# EasyEDA Pro project ProPrj_AIoT-NTU-Prototype_2026-03-28.epro, schematic Extension Board
Board Name: Extension Board; Create Date: 2026-03-23; Page Name: P1; Project Name: AIoT-NTU-Prototype; Schematic Name: Extension Board; Update Date: 2026-03-24; Company: EasyEDA.com; Page Size: A4; Version: V1.0
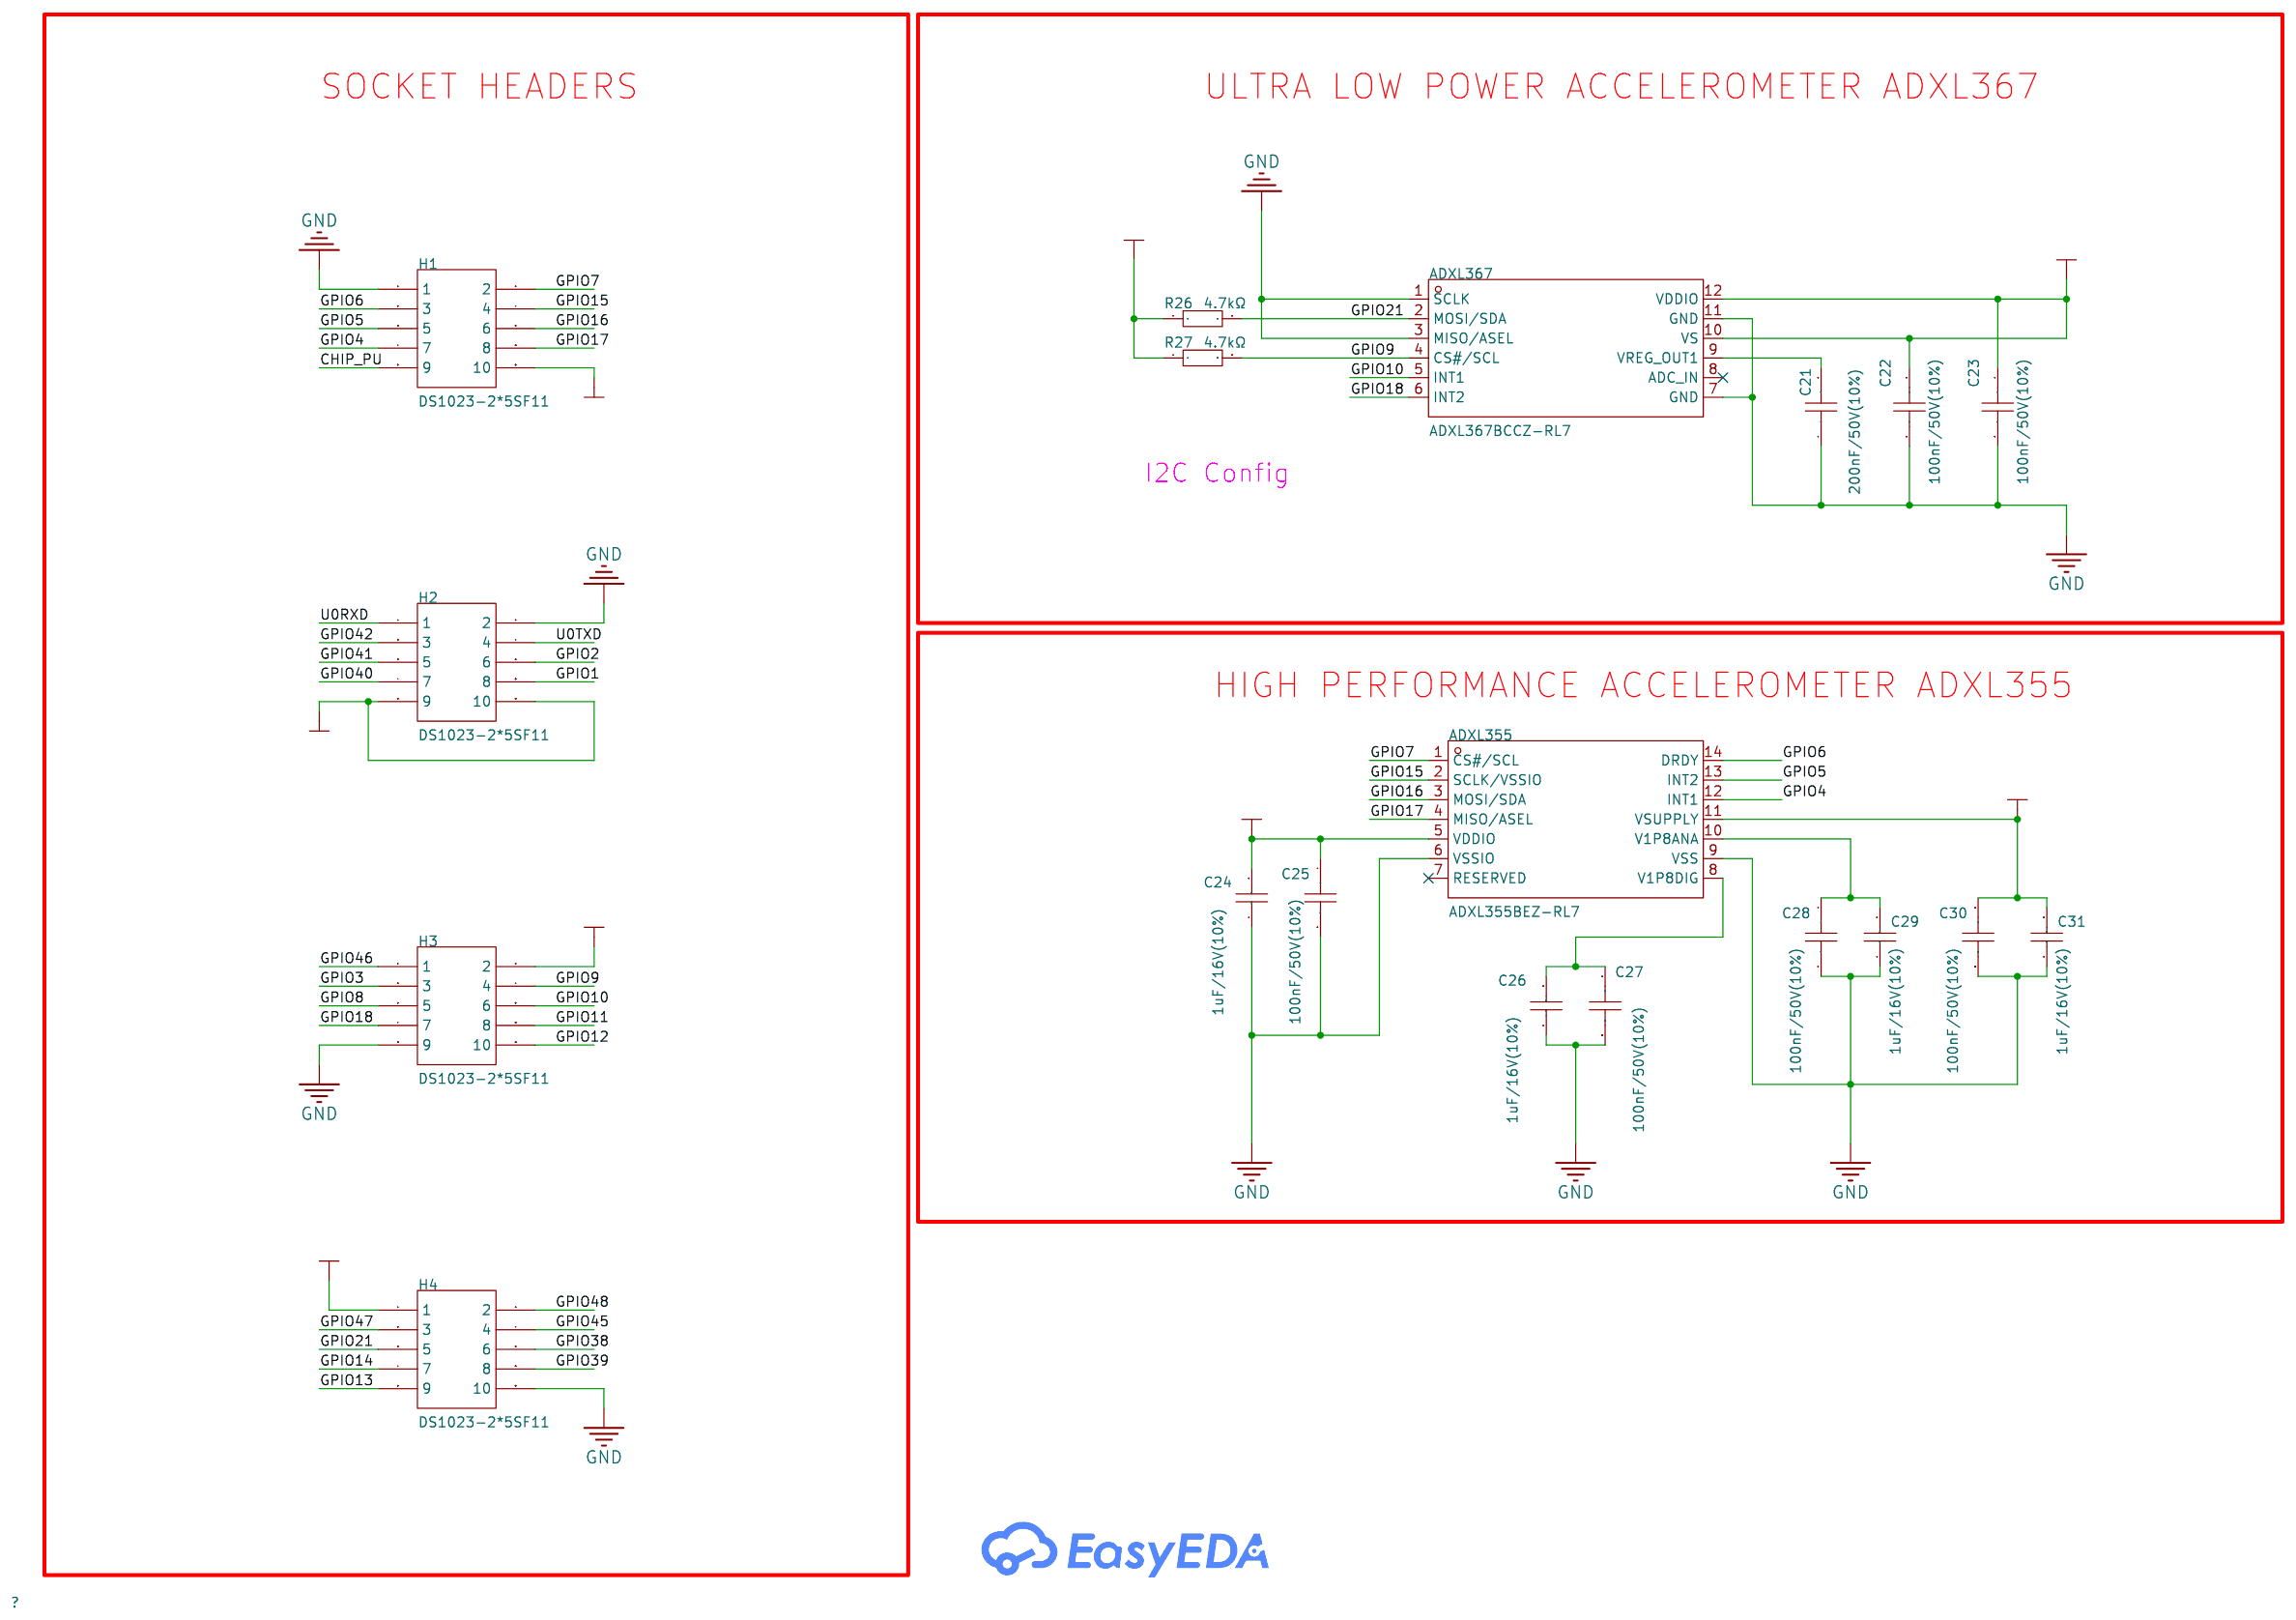
[diagram p0: schematic sheet]

## Parts
ADXL355  ADXL355BEZ-RL7  [LCC-14_L6.0-W6.0-P1.27-TL]
ADXL367  ADXL367BCCZ-RL7  [LGA-12_L2.3-W2.2-P0.50-TL]
C21  200nF/50V(10%)  [C0805]
C22  100nF/50V(10%)  [C0603]
C23  100nF/50V(10%)  [C0603]
C24  1uF/16V(10%)  [C0603]
C25  100nF/50V(10%)  [C0603]
C26  1uF/16V(10%)  [C0603]
C27  100nF/50V(10%)  [C0603]
C28  100nF/50V(10%)  [C0603]
C29  1uF/16V(10%)  [C0603]
C30  100nF/50V(10%)  [C0603]
C31  1uF/16V(10%)  [C0603]
H1  DS1023-2*5SF11  [HDR-TH_10P-P2.54-V-F-R2-C5-S2.54]
H2  DS1023-2*5SF11  [HDR-TH_10P-P2.54-V-F-R2-C5-S2.54]
H3  DS1023-2*5SF11  [HDR-TH_10P-P2.54-V-F-R2-C5-S2.54]
H4  DS1023-2*5SF11  [HDR-TH_10P-P2.54-V-F-R2-C5-S2.54]
R26  4.7kΩ  [R0603]
R27  4.7kΩ  [R0603]

## Library data of the parts
ADXL355 = ADXL355BEZ-RL7: LCSC Part Name: 带数字输出的低噪声、低漂移、低功耗3轴加速度计; Supplier Part: C515892; Manufacturer: ADI(亚德诺); Supplier Footprint: LCC-14(6x6); JLCPCB Part Class: Extended Part; Datasheet: https://item.szlcsc.com/datasheet/ADXL355BEZ-RL7/531509.html; Supplier: LCSC
ADXL367 = ADXL367BCCZ-RL7: Accelerometer Sensing Axis:X,Y,Z Acceleration Measurement Range (MAX):±8g Acceleration Measurement Range (MAX):±8g Sensor Type:Accelerometer Output Bits:14bit Interface:I2C；SPI Voltage - Supply:1.1V~3.6V Voltage - Supply:1.1V~3.6V Standby Current:40nA Ope; LCSC Part Name: 微功耗，三轴，±2 g/±4 g/±8 g 数字输出 MEMS 加速度计; Supplier Part: C17643415; Manufacturer: ADI(亚德诺); Supplier Footprint: LGA-12(2.2x2.3); JLCPCB Part Class: Extended Part; Datasheet: https://item.szlcsc.com/datasheet/ADXL367BCCZ-RL7/18772676.html; Supplier: LCSC; Accelerometer Sensing Axis: X,Y,Z; Acceleration Measurement Range (MAX): ±8g; Sensor Type: Accelerometer; Output Bits: 14bit; Interface: I2C；SPI; Voltage - Supply: 1.1V~3.6V; Standby Current: 40nA; Operating Temperature: -40℃~+85℃
C21 = NL0805B204K500CPBN: Capacitance:200nF Tolerance:±10% Tolerance:±10% Voltage Rating:50V Temperature Coefficient:-; LCSC Part Name: 200nF ±10% 50V; Supplier Part: C918135; Manufacturer: HUI JU(汇聚); Supplier Footprint: 0805; JLCPCB Part Class: Extended Part; Datasheet: https://item.szlcsc.com/datasheet/NL0805B204K500CPBN/994086.html; Supplier: LCSC; Tolerance: ±10%; Voltage Rating: 50V
C22 C23 C25 C27 C28 C30 = CC0603KRX7R9BB104: Capacitance:100nF Tolerance:±10% Tolerance:±10% Voltage Rating:50V Temperature Coefficient:X7R; LCSC Part Name: 100nF ±10% 50V; Supplier Part: C14663; Manufacturer: YAGEO(国巨); Supplier Footprint: 0603; JLCPCB Part Class: Basic Part; Datasheet: https://item.szlcsc.com/datasheet/CC0603KRX7R9BB104/15331.html; Supplier: LCSC; Tolerance: ±10%; Voltage Rating: 50V; Temperature Coefficient: X7R
C24 C26 C29 C31 = CL10A105KO8NNNC: Capacitance:1uF Tolerance:±10% Tolerance:±10% Voltage Rating:16V Temperature Coefficient:X5R; LCSC Part Name: 1uF ±10% 16V; Supplier Part: C1592; Manufacturer: SAMSUNG(三星); Supplier Footprint: 0603; JLCPCB Part Class: Extended Part; Datasheet: https://item.szlcsc.com/datasheet/CL10A105KO8NNNC/1944.html; Supplier: LCSC; Tolerance: ±10%; Voltage Rating: 16V; Temperature Coefficient: X5R
H1-H4 = DS1023-2*5SF11: Holes Structure:2x5P Pitch:2.54mm Row Spacing:2.54mm Mounting Type:Through Hole Number of Rows:2 Number of Positions:10P Current Rating:3A Voltage Rating (Max):600V Holes Direction:Top Insulation Height:8.5mm Contact Material:- Contact Plating:Gold Operat; LCSC Part Name: 黑色 2x5P 间距:2.54mm 直插; Supplier Part: C92270; Manufacturer: CONNFLY; Supplier Footprint: 插件,P=2.54mm; JLCPCB Part Class: Extended Part; Datasheet: https://item.szlcsc.com/datasheet/DS1023-2*5SF11/93463.html; Supplier: LCSC; Holes Structure: 2x5P; Pitch: 2.54mm; Row Spacing: 2.54mm; Mounting Type: Through Hole; Number of Rows: 2; Number of Positions: 10P; Current Rating: 3A; Voltage Rating (Max): 600V; Holes Direction: Top; Insulation Height: 8.5mm; Contact Plating: Gold; Operating Temperature: -40℃~+105℃
R26 R27 = 0603WAF4701T5E: Type:Thick Film Resistor Resistance:4.7kΩ Tolerance:±1% Tolerance:±1% Power(Watts):100mW Voltage-Supply(Max):75V Temperature Coefficient:±100ppm/℃ Temperature Coefficient:±100ppm/℃ Operating Temperature:-55℃~+155℃ Operating Temperature:-55℃~+155℃; LCSC Part Name: 4.7kΩ ±1% 100mW 厚膜电阻; Supplier Part: C23162; Manufacturer: UNI-ROYAL(厚声); Supplier Footprint: 0603; Datasheet: https://item.szlcsc.com/datasheet/0603WAF4701T5E/23889.html; Supplier: LCSC; Type: Thick Film Resistor; Tolerance: ±1%; Power(Watts): 100mW; Voltage-Supply(Max): 75V; Temperature Coefficient: ±100ppm/℃; Operating Temperature: -55℃~+155℃

## Nets
GND: ADXL355.6(VSSIO) ADXL355.9(VSS) ADXL367.1(SCLK) ADXL367.3(MISO/ASEL) ADXL367.7(GND) ADXL367.11(GND) C21.1 C22.2 C23.2 C24.1 C25.2 C26.1 C27.2 C28.2 C29.1 C30.2 C31.1 H1.1 H2.2 H3.9 H4.10
CHIP_PU: H1.9
ESP_3V3: ADXL355.5(VDDIO) ADXL355.11(VSUPPLY) ADXL367.10(VS) ADXL367.12(VDDIO) C22.1 C23.1 C24.2 C25.1 C30.1 C31.2 H1.10 H2.9 H2.10 H3.2 H4.1 R26.1 R27.1
GPIO1: H2.8
GPIO2: H2.6
GPIO3: H3.3
GPIO4: ADXL355.12(INT1) H1.7
GPIO5: ADXL355.13(INT2) H1.5
GPIO6: ADXL355.14(DRDY) H1.3
GPIO7: ADXL355.1(CS#/SCL) H1.2
GPIO8: H3.5
GPIO9: ADXL367.4(CS#/SCL) H3.4 R27.2
GPIO10: ADXL367.5(INT1) H3.6
GPIO11: H3.8
GPIO12: H3.10
GPIO13: H4.9
GPIO14: H4.7
GPIO15: ADXL355.2(SCLK/VSSIO) H1.4
GPIO16: ADXL355.3(MOSI/SDA) H1.6
GPIO17: ADXL355.4(MISO/ASEL) H1.8
GPIO18: ADXL367.6(INT2) H3.7
GPIO21: ADXL367.2(MOSI/SDA) H4.5 R26.2
GPIO38: H4.6
GPIO39: H4.8
GPIO40: H2.7
GPIO41: H2.5
GPIO42: H2.3
GPIO45: H4.4
GPIO46: H3.1
GPIO47: H4.3
GPIO48: H4.2
U0RXD: H2.1
U0TXD: H2.4
$1N763: ADXL367.9(VREG_OUT1) C21.2
$1N767: ADXL355.8(V1P8DIG) C26.2 C27.1
$1N769: ADXL355.10(V1P8ANA) C28.1 C29.2

Not connected (* = marked no-connect by the designer): ADXL355 7(RESERVED)*; ADXL367 8(ADC_IN)*

## Notes on the sheet
- SOCKET HEADERS
- ULTRA LOW POWER ACCELEROMETER ADXL367
- I2C Config
- HIGH PERFORMANCE ACCELEROMETER ADXL355
